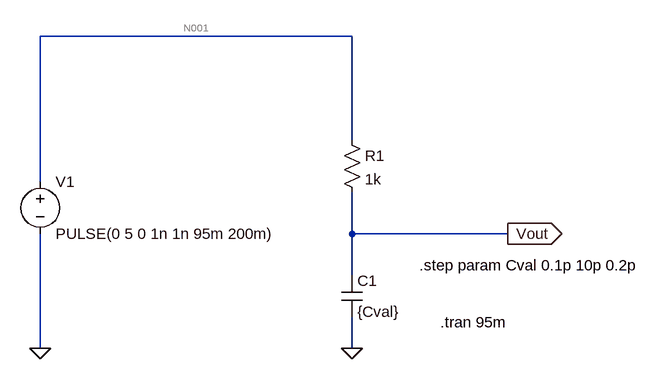
[diagram p0: schematic rc_short_sweep.asc]
rc_short_sweep.asc, the LTspice schematic file:
Version 4.1
SHEET 1 880 680
WIRE -512 -64 -992 -64
WIRE -512 96 -512 -64
WIRE -992 160 -992 -64
WIRE -512 240 -512 176
WIRE -272 240 -512 240
WIRE -512 304 -512 240
WIRE -992 416 -992 240
WIRE -512 416 -512 368
FLAG -272 240 Vout
IOPIN -272 240 Out
FLAG -992 416 0
FLAG -512 416 0
SYMBOL voltage -992 144 R0
WINDOW 123 0 0 Left 0
WINDOW 39 0 0 Left 0
SYMATTR InstName V1
SYMATTR Value PULSE(0 5 0 1n 1n 95m 200m)
SYMBOL res -528 80 R0
SYMATTR InstName R1
SYMATTR Value 1k
SYMBOL cap -528 304 R0
SYMATTR InstName C1
SYMATTR Value {Cval}
SYMATTR SpiceLine V=6.3 Irms=0 Rser=4 Lser=0
TEXT -376 376 Left 2 !.tran 95m
TEXT -408 288 Left 2 !.step param Cval 0.1p 10p 0.2p

The netlist it stands for:
* rc_short_sweep.asc
V1 N001 0 PULSE(0 5 0 1n 1n 95m 200m)
R1 N001 Vout 1k
C1 Vout 0 {Cval} V=6.3 Irms=0 Rser=4 Lser=0
.tran 95m
.step param Cval 0.1p 10p 0.2p
.backanno
.end

* Results of the author's LTspice run, read from the files saved beside the schematic
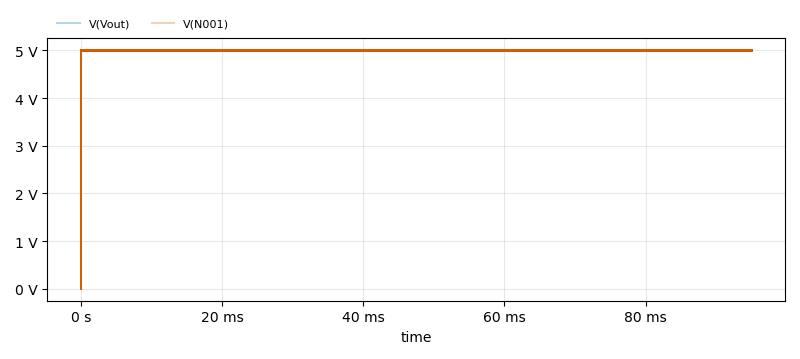
[diagram p1: Transient Analysis of rc_short_sweep.asc, plotted from the saved traces]
* Transient Analysis, 51 runs:
*   V(Vout) [run 1]: min 0 V, max 5 V, average 5 V, rms 5 V, last 5 V
*   V(Vout) [run 2]: min 0 V, max 5 V, average 5 V, rms 5 V, last 5 V
*   V(Vout) [run 3]: min 0 V, max 5 V, average 5 V, rms 5 V, last 5 V
*   V(Vout) [run 4]: min 0 V, max 5 V, average 5 V, rms 5 V, last 5 V
*   V(Vout) [run 5]: min 0 V, max 5 V, average 5 V, rms 5 V, last 5 V
*   V(Vout) [run 6]: min 0 V, max 5 V, average 5 V, rms 5 V, last 5 V
*   V(Vout) [run 7]: min 0 V, max 5 V, average 5 V, rms 5 V, last 5 V
*   V(Vout) [run 8]: min 0 V, max 5 V, average 5 V, rms 5 V, last 5 V
*   V(N001) [run 1]: min 0 V, max 5 V, average 5 V, rms 5 V, last 5 V
*   V(N001) [run 2]: min 0 V, max 5 V, average 5 V, rms 5 V, last 5 V
*   V(N001) [run 3]: min 0 V, max 5 V, average 5 V, rms 5 V, last 5 V
*   V(N001) [run 4]: min 0 V, max 5 V, average 5 V, rms 5 V, last 5 V
*   V(N001) [run 5]: min 0 V, max 5 V, average 5 V, rms 5 V, last 5 V
*   V(N001) [run 6]: min 0 V, max 5 V, average 5 V, rms 5 V, last 5 V
*   V(N001) [run 7]: min 0 V, max 5 V, average 5 V, rms 5 V, last 5 V
*   V(N001) [run 8]: min 0 V, max 5 V, average 5 V, rms 5 V, last 5 V